# Altium schematic sheet dcdc_5v0_3v3.SchDoc
size 220 x 124 mm; SheetNumber: 1; SheetTotal: 1
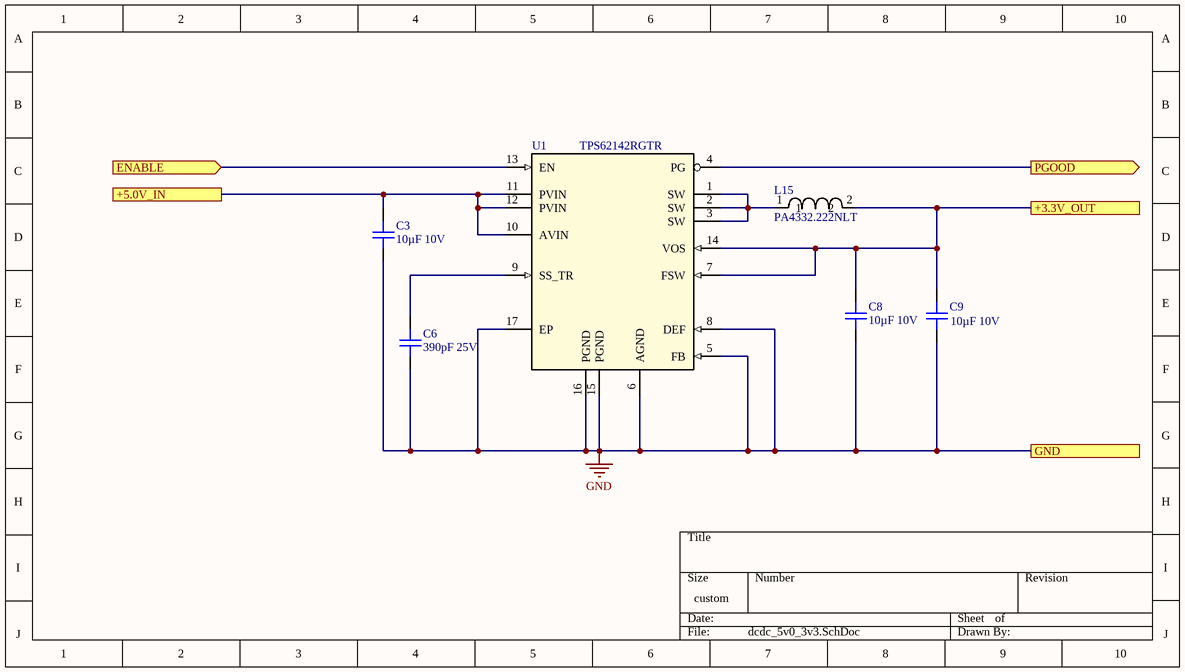
[diagram p0: dcdc_5v0_3v3.SchDoc]

## Parts
C3  10µF 10V  [0805C]
C6  390pF 25V  [0402C]
C8  10µF 10V  [0805C]
C9  10µF 10V  [0805C]
L15  PA4332.222NLT  [PA4332]
U1  TPS62142RGTR  [RGT0016C]

## Ports
+3.3V_OUT, +5.0V_IN, ENABLE (in), GND, PGOOD (out)

## Nets
GND: C3.2 C6.1 C8.2 C9.2 U1.5(FB) U1.6(AGND) U1.8(DEF) U1.15(PGND) U1.16(PGND) U1.17(EP) ; port GND
+3.3V_OUT: C8.1 C9.1 L15.2 U1.7(FSW) U1.14(VOS) ; port +3.3V_OUT
+5.0V_IN: C3.1 U1.10(AVIN) U1.11(PVIN) U1.12(PVIN) ; port +5.0V_IN
ENABLE: U1.13(EN) ; port ENABLE
PGOOD: U1.4(PG) ; port PGOOD
NetC6_2: C6.2 U1.9(SS_TR)
NetL15_1: L15.1 U1.1(SW) U1.2(SW) U1.3(SW)

## Library data of the parts
C3 C8 C9 = gen_C_ceramic_10u_10V_X7R_0805: Ceramic, 10µF, ±10%, 10V, X7R, –55 to 125°C, 0805 (2012),RoHS, Automotive; Part Number: GCJ21BR71A106KE01; Manufacturer: Murata; Case EIA: 0805; Case Metric: 2012; Automotive Qualified: True; PnP Package: C_0805_10; PnP Value: 10µF/10V/X7R; Capacitance: 10µF; Dielectric: X7R; Rated Voltage: 10V; Height - Seated (Max): 1.25mm; Mounting Type: SurfaceMount,MLCC; Operating Temperature: –55 to 125°C; Series: GCJ; Tolerance: ±10%; Manufacturer_Part_Number: GCJ21BR71A106KE01; Supplier 1: Digi-Key; Supplier Part Number 1: 490-12646-1-ND
C6 = gen_C_ceramic_390p_25V_C0G_0402: Ceramic, 390pF, ±5%, 25V, C0G, 25 to 125°C, 0402 (1005),RoHS, Automotive; Part Number: GCM1555C1H180JA16#; Manufacturer: Murata; Capacitance: 18p; Rated Voltage: 50V; Case EIA: 0402; Case Metric: 1005; Automotive Qualified: True; PnP Package: C_0402_10; PnP Value: 18pF/50V/X7R; Dielectric: C0G; Supplier 1: Digi-Key; Supplier Part Number 1: 490-12650-1-ND; Height - Seated (Max): 0.5mm; Mounting Type: SurfaceMount,MLCC; Operating Temperature: 25 to 125°C; Series: GCM; Tolerance: ±5%; Manufacturer_Part_Number: GCM1555C1H180JA16#
L15 = PA4332.222NLT: Imported; Vendor: Pulse Engineering; Manufacturer_Part_Number: PA4332.222NLT; RefDes: RefDes; TYPE: TYPE; Value: Value
U1 = TPS62142RGTR: Imported; Manufacturer: Texas Instruments; PartNumber: TPS62142RGTR; RefDes: RefDes; TYPE: TYPE; Value: Value